# EAGLE design Qwiic RFID - IDXXLA-BottomJig (EAGLE 9.2.1)
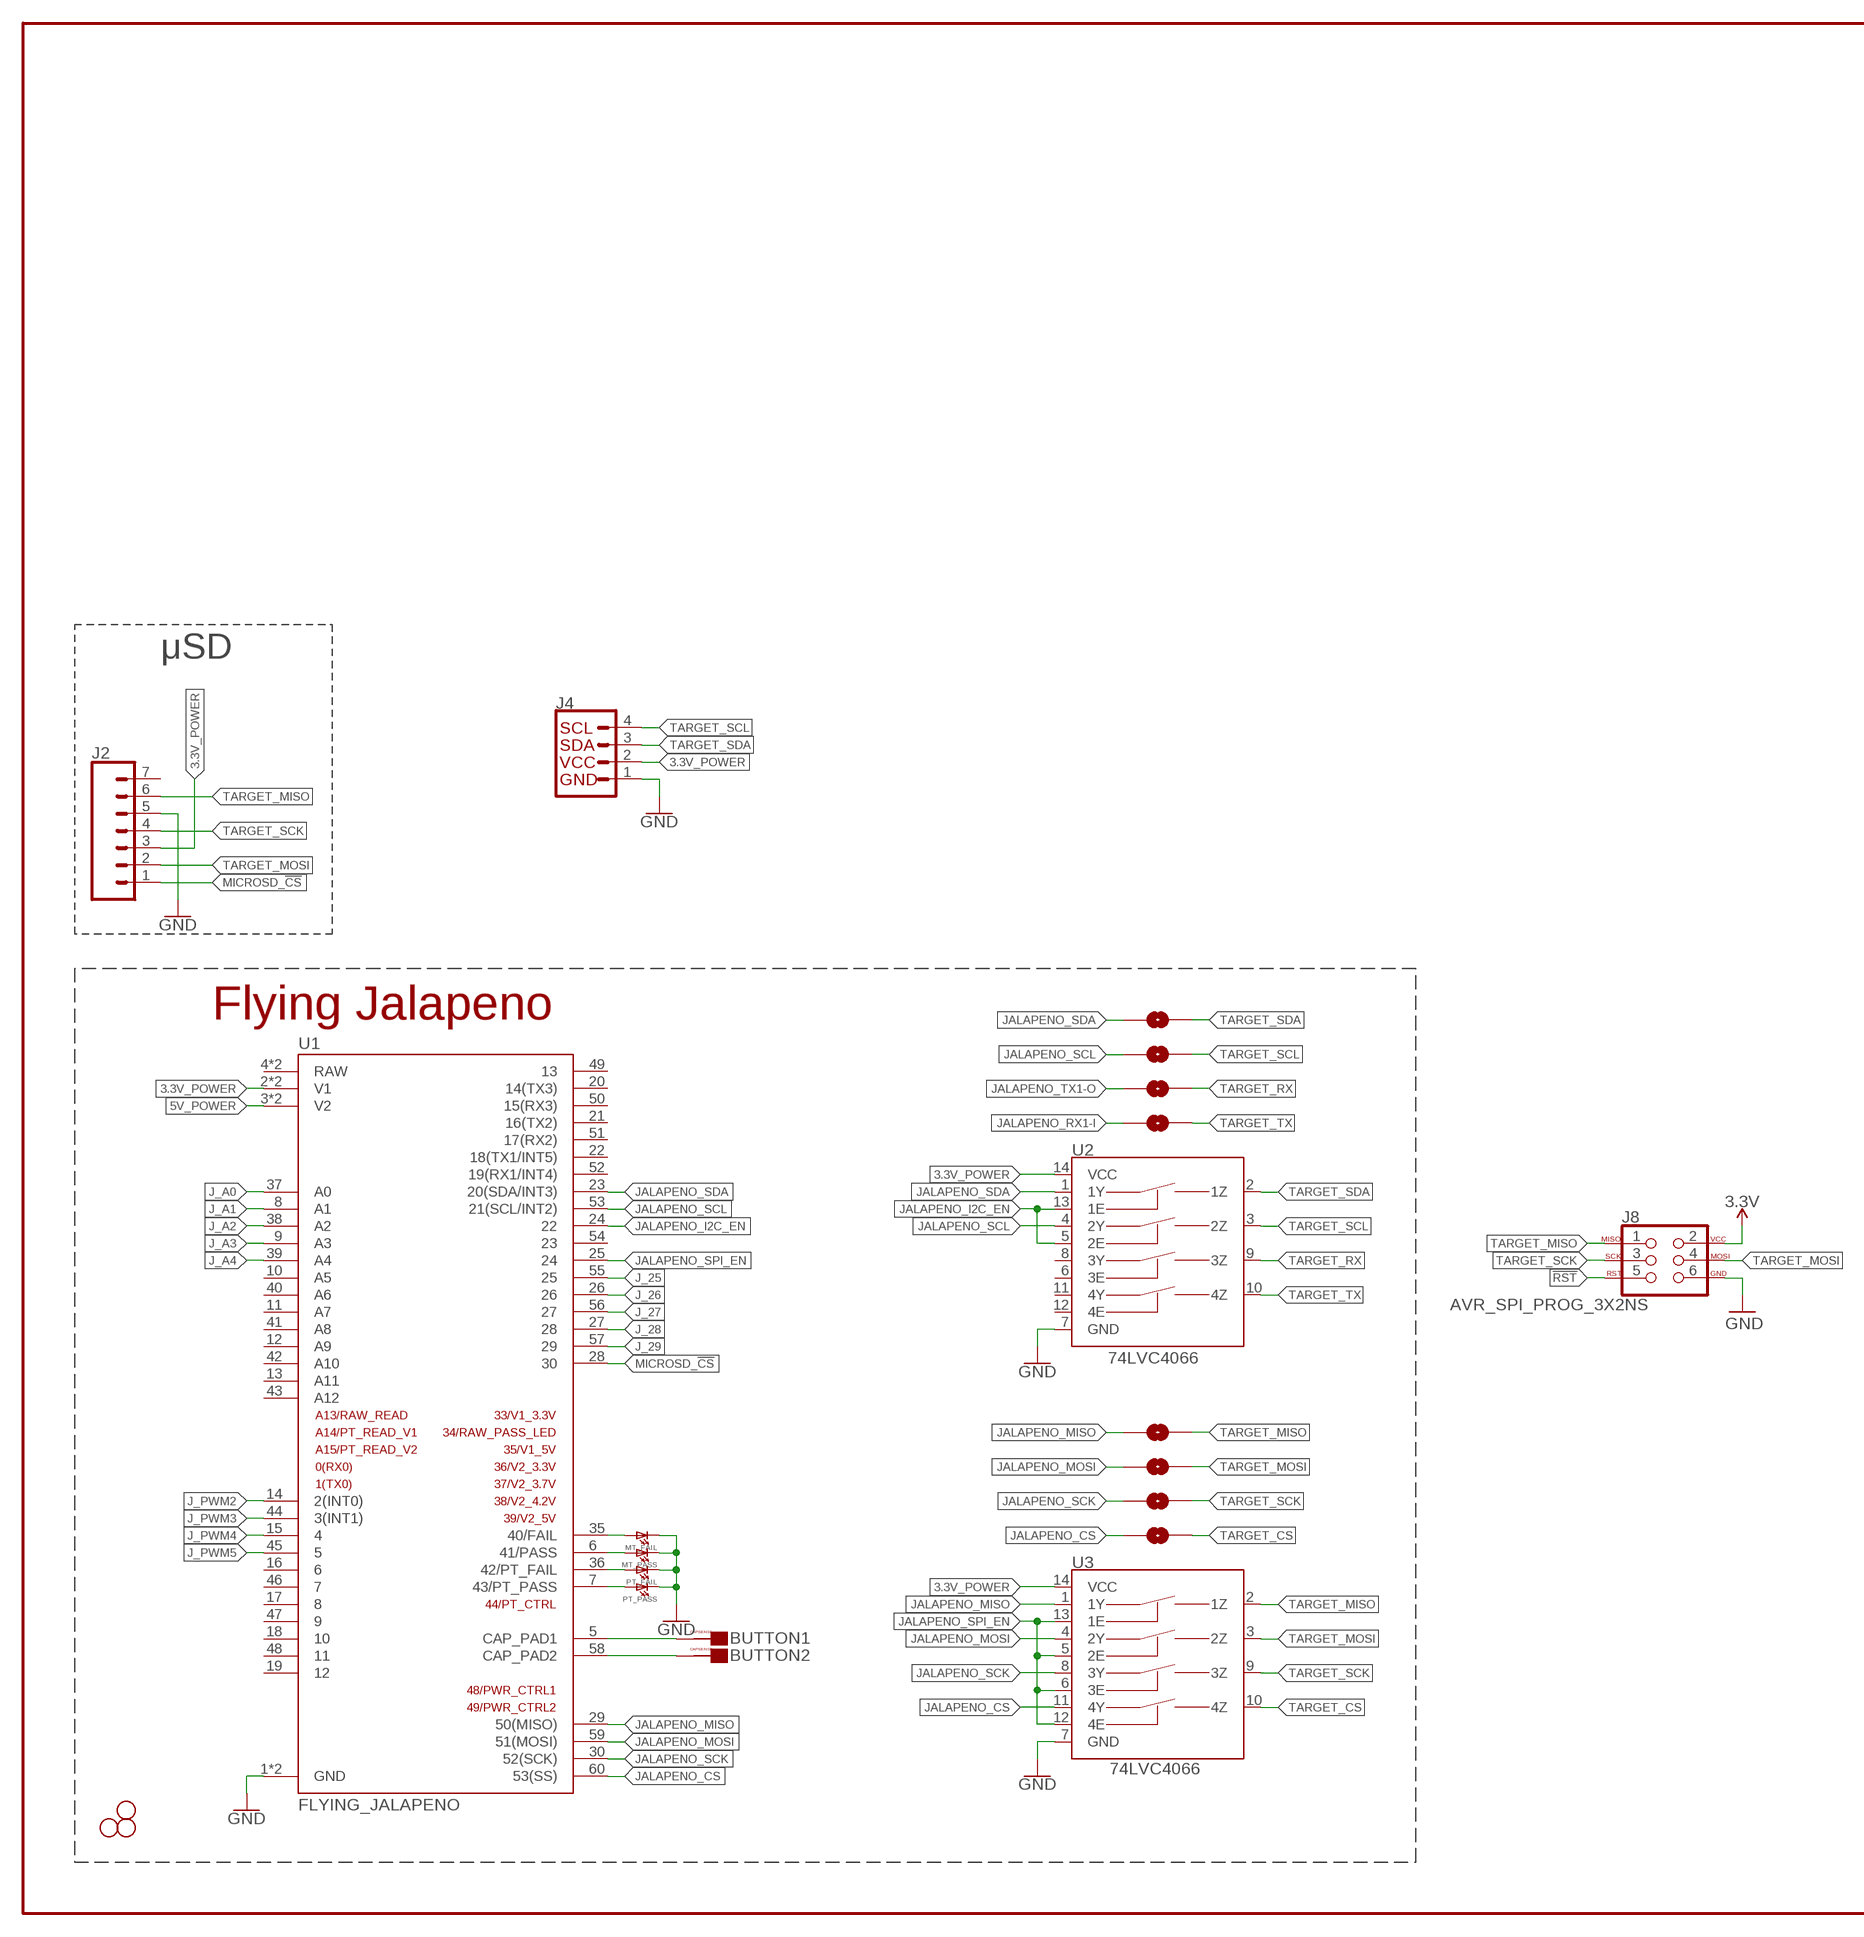
[diagram p0: schematic, sheet 1, part 1 of 2]
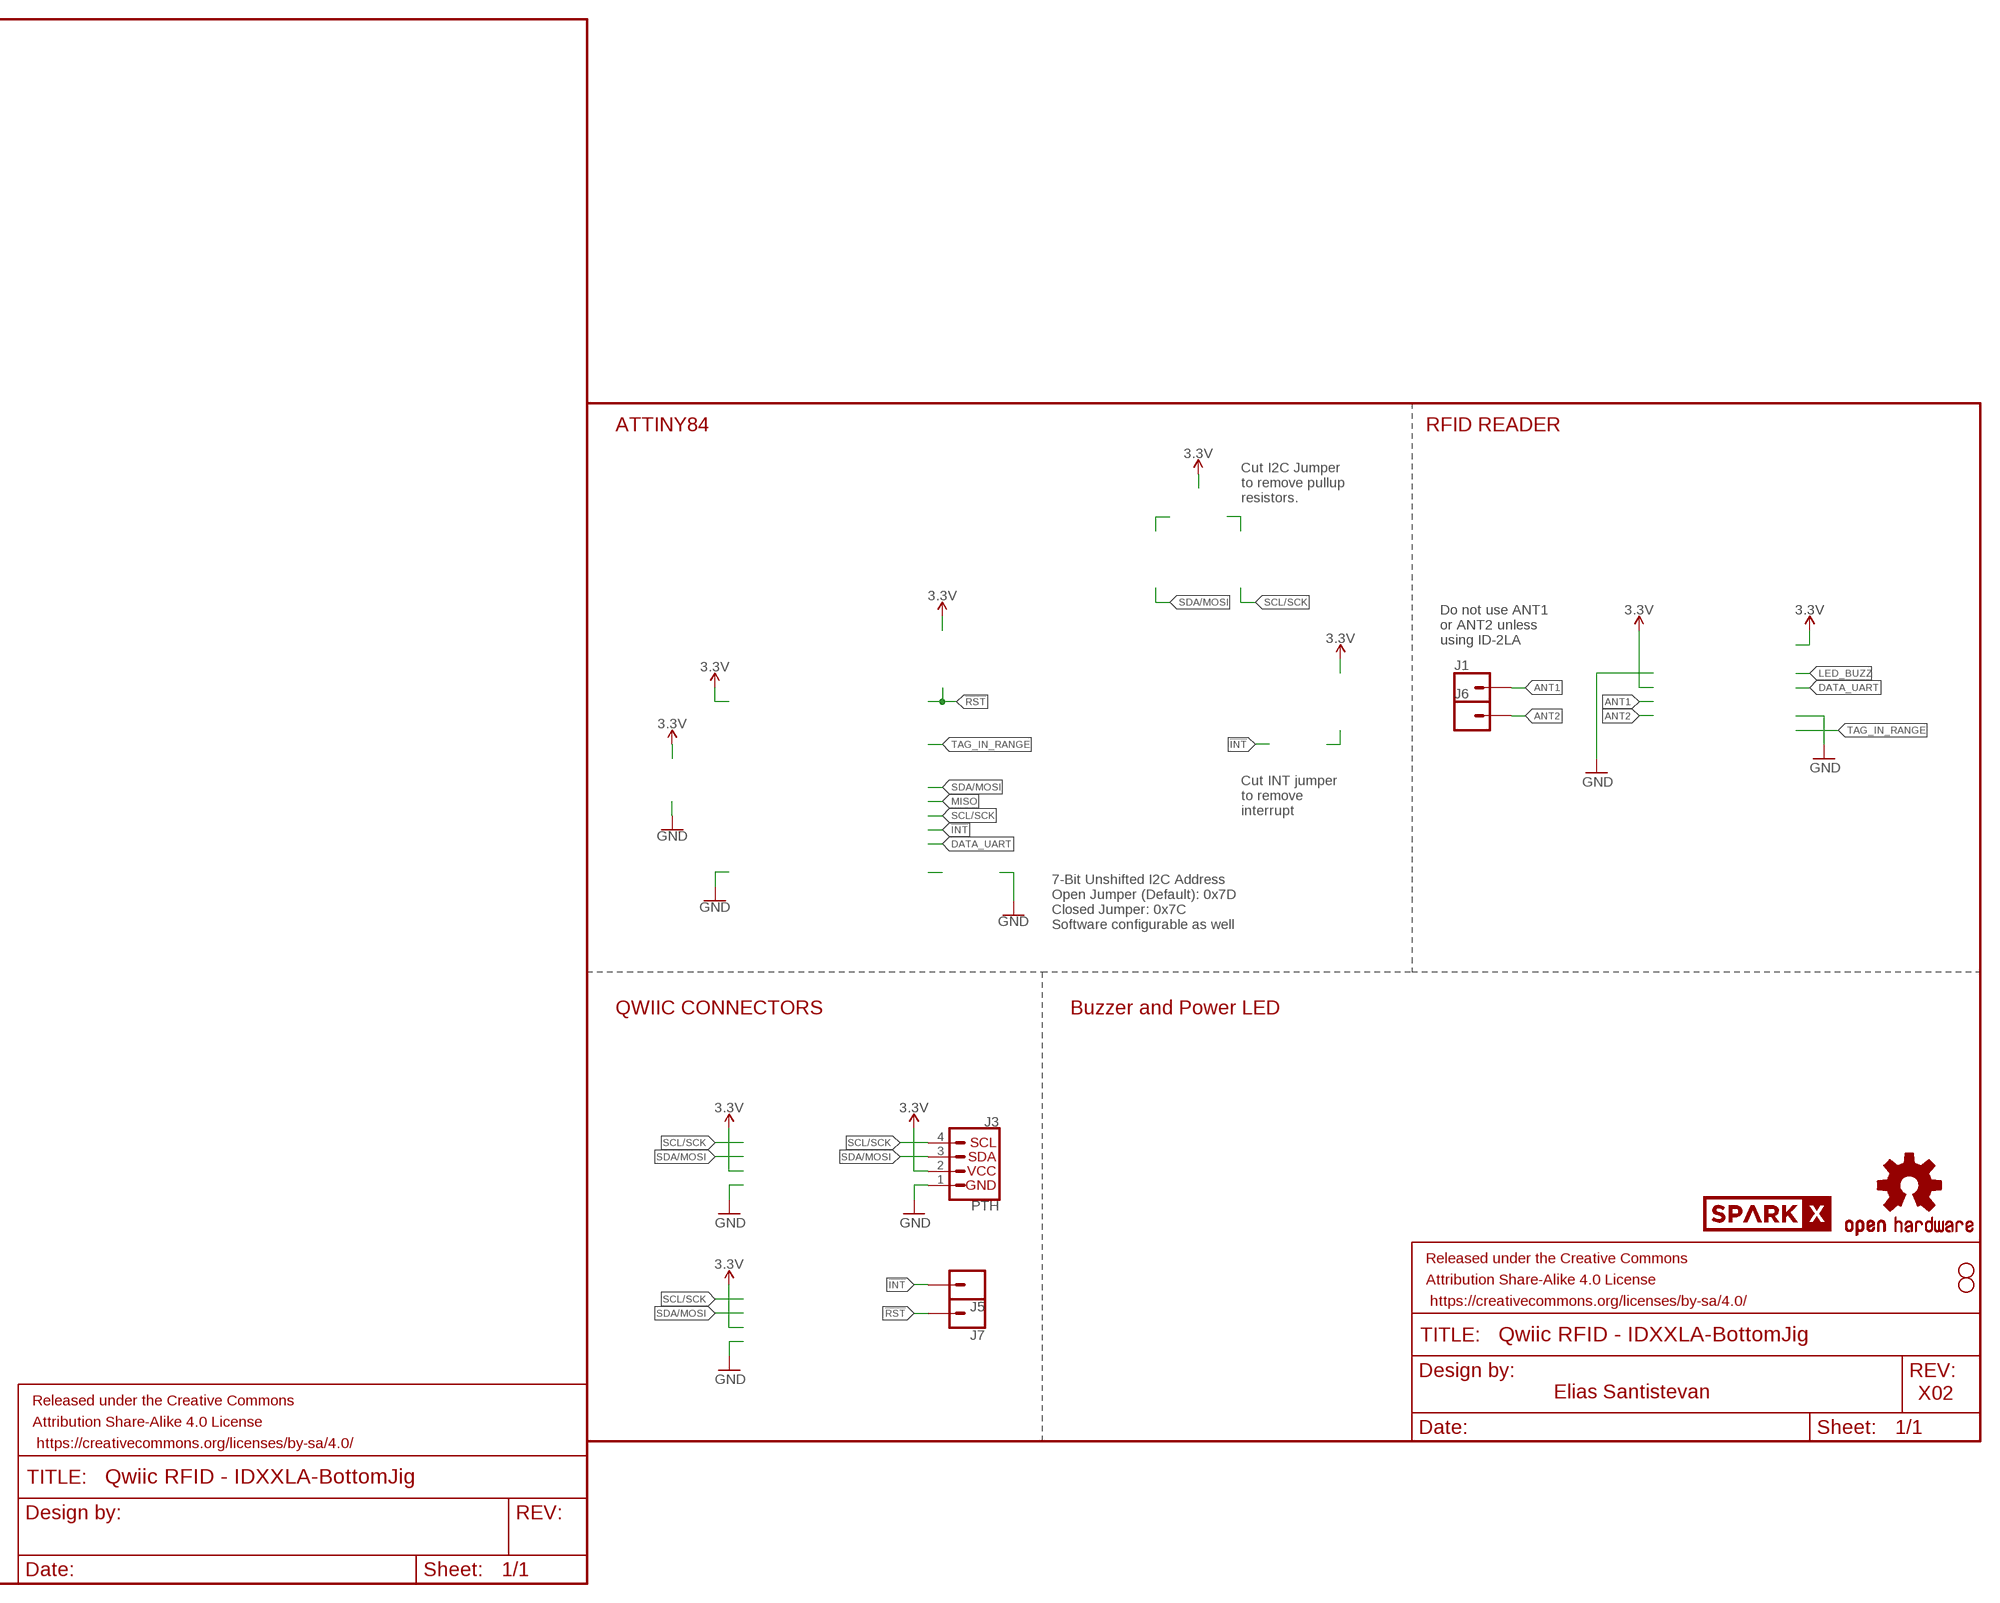
[diagram p1: schematic, sheet 1, part 2 of 2]

## Parts
BUTTON1  CAPSENSE_BUTTON_PAD_ONLY  [CAPSENSE_BUTTON_PADS_ONLY]
BUTTON2  CAPSENSE_BUTTON_PAD_ONLY  [CAPSENSE_BUTTON_PADS_ONLY]
FRAME1  FRAME-LETTER  [CREATIVE_COMMONS]
FRAME2  FRAME-LEDGER  [CREATIVE_COMMONS]
H1  STAND-OFF  [STAND-OFF]
H3  STAND-OFF  [STAND-OFF]
H4  STAND-OFF  [STAND-OFF]
J1  CONN_01PTH_NO_SILK_YES_STOP  [1X01_NO_SILK]
J2  CONN_07  [1X07]
J3  PTH  I2C_STANDARD_NO_SILK  [1X04_NO_SILK]
J4  QWIIC_CONNECTORJS-1MM  [1X04_1MM_RA]
J5  CONN_01PTH_NO_SILK_YES_STOP  [1X01_NO_SILK]
J6  CONN_01PTH_NO_SILK_YES_STOP  [1X01_NO_SILK]
J7  CONN_01PTH_NO_SILK_YES_STOP  [1X01_NO_SILK]
J8  AVR_SPI_PROG_3X2NS  [2X3-NS]
J_SCL  JUMPER-SMT_2_NO_NO-SILK  [SMT-JUMPER_2_NO_NO-SILK]
J_SCL1  JUMPER-SMT_2_NO_NO-SILK  [SMT-JUMPER_2_NO_NO-SILK]
J_SCL2  JUMPER-SMT_2_NO_NO-SILK  [SMT-JUMPER_2_NO_NO-SILK]
J_SCL3  JUMPER-SMT_2_NO_NO-SILK  [SMT-JUMPER_2_NO_NO-SILK]
J_SCL4  JUMPER-SMT_2_NO_NO-SILK  [SMT-JUMPER_2_NO_NO-SILK]
J_SCL5  JUMPER-SMT_2_NO_NO-SILK  [SMT-JUMPER_2_NO_NO-SILK]
J_SDA  JUMPER-SMT_2_NO_NO-SILK  [SMT-JUMPER_2_NO_NO-SILK]
J_SDA1  JUMPER-SMT_2_NO_NO-SILK  [SMT-JUMPER_2_NO_NO-SILK]
JP3  STAND-OFF  [STAND-OFF]
JP4  STAND-OFF  [STAND-OFF]
LOGO1  OSHW-LOGOMINI  [OSHW-LOGO-MINI]
MT_FAIL  LED1206  [LED-1206]
MT_PASS  LED1206  [LED-1206]
PT_FAIL  LED1206  [LED-1206]
PT_PASS  LED1206  [LED-1206]
U1  FLYING_JALAPENO  FLYING_JALAPENO_V3MALE  [FLYING_JALAPENO_V3_M]
U2  74LVC4066  74LVC4066_MUX_1:1_X4  [SO14]
U3  74LVC4066  74LVC4066_MUX_1:1_X4  [SO14]
U$4  SPARKX-LOGO3  [SPARKX-SMALL]

## Nets
3.3V: J3.2(VCC) J8.2
3.3V_POWER [VCC]: J2.3 J4.2 U1.2(V1) U1.32(V1) U2.14(VCC) U3.14(VCC)
5V_POWER [POWA]: U1.3(V2) U1.33(V2)
!INT: J5.1
!RST: J7.1 J8.5
ANT1: J1.1
ANT2: J6.1
BUTTON1 [CAPSENSE]: BUTTON1.CAPSENSE_PAD(CAPSENSE) U1.5(CAP_PAD1)
BUTTON2 [CAPSENSE]: BUTTON2.CAPSENSE_PAD(CAPSENSE) U1.58(CAP_PAD2)
GND: J2.5 J3.1(GND) J4.1 J8.6 MT_FAIL.C MT_PASS.C PT_FAIL.C PT_PASS.C U1.1(GND) U1.31(GND) U2.7(GND) U3.7(GND)
J_25: U1.55
J_26: U1.26
J_27: U1.56
J_28: U1.27
J_29: U1.57
J_A0: U1.37(A0)
J_A1: U1.8(A1)
J_A2: U1.38(A2)
J_A3: U1.9(A3)
J_A4: U1.39(A4)
J_PWM2: U1.14(2(INT0))
J_PWM3: U1.44(3(INT1))
J_PWM4: U1.15
J_PWM5: U1.45
JALAPENO_CS: J_SDA1.1 U1.60(53(SS)) U3.11(4Y)
JALAPENO_I2C_EN: U1.24 U2.5(2E) U2.13(1E)
JALAPENO_MISO: J_SCL5.1 U1.29(50(MISO)) U3.1(1Y)
JALAPENO_MOSI: J_SCL3.1 U1.59(51(MOSI)) U3.4(2Y)
JALAPENO_RX1-I: J_SDA.1
JALAPENO_SCK: J_SCL4.1 U1.30(52(SCK)) U3.8(3Y)
JALAPENO_SCL: J_SCL.1 U1.53(21(SCL/INT2)) U2.4(2Y)
JALAPENO_SDA: J_SCL2.1 U1.23(20(SDA/INT3)) U2.1(1Y)
JALAPENO_SPI_EN: U1.25 U3.5(2E) U3.6(3E) U3.12(4E) U3.13(1E)
JALAPENO_TX1-O: J_SCL1.1
MICROSD_!CS!: J2.1 U1.28
MT_FAIL: MT_FAIL.A U1.35(40/FAIL)
MT_PASS: MT_PASS.A U1.6(41/PASS)
PT_FAIL: PT_FAIL.A U1.36(42/PT_FAIL)
PT_PASS: PT_PASS.A U1.7(43/PT_PASS)
SCL/SCK: J3.4(SCL)
SDA/MOSI: J3.3(SDA)
TARGET_CS: J_SDA1.2 U3.10(4Z)
TARGET_MISO: J2.6 J8.1 J_SCL5.2 U3.2(1Z)
TARGET_MOSI: J2.2 J8.4 J_SCL3.2 U3.3(2Z)
TARGET_RX: J_SCL1.2 U2.9(3Z)
TARGET_SCK: J2.4 J8.3 J_SCL4.2 U3.9(3Z)
TARGET_SCL: J4.4 J_SCL.2 U2.3(2Z)
TARGET_SDA: J4.3 J_SCL2.2 U2.2(1Z)
TARGET_TX: J_SDA.2 U2.10(4Z)
Unconnected: J2.7 U1.4(RAW) U1.10(A5) U1.11(A7) U1.12(A9) U1.13(A11) U1.16 U1.17 U1.18 U1.19 U1.20(14(TX3)) U1.21(16(TX2)) U1.22(18(TX1/INT5)) U1.34(RAW) U1.40(A6) U1.41(A8) U1.42(A10) U1.43(A12) U1.46 U1.47 U1.48 U1.49 U1.50(15(RX3)) U1.51(17(RX2)) U1.52(19(RX1/INT4)) U1.54 U2.6(3E) U2.8(3Y) U2.11(4Y) U2.12(4E)

## Notes on the sheet
- ATTINY84 | RFID READER
- Cut I2C Jumper
  to remove pullup 
  resistors.
- μSD
- Do not use ANT1 
  or ANT2 unless 
  using ID-2LA
- Cut INT jumper
  to remove 
  interrupt
- Flying Jalapeno
- 7-Bit Unshifted I2C Address
  Open Jumper (Default): 0x7D
  Closed Jumper: 0x7C
  Software configurable as well
- QWIIC CONNECTORS | Buzzer and Power LED
- Elias Santistevan | X02

## Library data of the parts
BUTTON1 BUTTON2 = Testing:CAPSENSE_BUTTON_PAD_ONLY
FRAME1 = SparkFun-Aesthetics:FRAME-LETTER: Schematic Frame - Letter Standard 8.5x11 US Letter frame
FRAME2 = SparkFun-Aesthetics:FRAME-LEDGER: Schematic Frame - Ledger Standard 11x14 US Ledger frame
H1 H3 H4 = SparkFun-Hardware:STAND-OFF: Stand Off
J1 J5-J7 = SparkFun-Connectors:CONN_01: Single connection point. Often used as Generic Header-pin footprint for 0.1 inch spaced/style header connections On any of the 0.1 inch spaced packages, you can populate with these: Break Away Headers - Straight <https://www.sparkfun.com/products/116> (PRT-00116) Break Away Male Headers - Right Angle <https://www.sparkfun.com/products/553> (PRT-00553) Female Headers <https://www.sparkfun.com/products/115> (PRT-00115) Break Away Headers - Machine Pin <https://www.sparkfun.com/products/117> (PRT-00117) Break Away Female Headers - Swiss Machine Pin <https://www.sparkfun.com/products/743> (PRT-00743) This device is also useful as a general connection point to wire up your design to another part of your project. Our various solder wires solder well into these plated through hole pads. Hook-Up Wire - Assortment (Stranded, 22 AWG) <https://www.sparkfun.com/products/11375> (PRT-11375) Hook-Up Wire - Assortment (Solid Core, 22 AWG) <https://www.sparkfun.com/products/11367> (PRT-11367) View the entire wire category on our website here <https://www.sparkfun.com/categories/141> Special notes: SMTSO-256-ET is a "flush mount" nut for a 4-40 screw. We mostly use this on specialty testbeds; it is a nice way to connect hardware to your PCB at an adjustable hieght. Also note, the SNAP packages are for using a snappable style connector. We sell a baggie of snaps and they are also used on two LilyPad designs: Snap Assortment - 30 pack (male and female) <https://www.sparkfun.com/products/11347> (DEV-11347) LilyPad Arduino SimpleSnap <https://www.sparkfun.com/products/10941> (DEV-10941) LilyPad SimpleSnap Protoboard <https://www.sparkfun.com/products/10940> (DEV-10940)
J2 = SparkFun-Connectors:CONN_07: Multi connection point. Often used as Generic Header-pin footprint for 0.1 inch spaced/style header connections On any of the 0.1 inch spaced packages, you can populate with these: Break Away Headers - Straight <https://www.sparkfun.com/products/116> (PRT-00116) Break Away Male Headers - Right Angle <https://www.sparkfun.com/products/553> (PRT-00553) Female Headers <https://www.sparkfun.com/products/115> (PRT-00115) Break Away Headers - Machine Pin <https://www.sparkfun.com/products/117> (PRT-00117) Break Away Female Headers - Swiss Machine Pin <https://www.sparkfun.com/products/743> (PRT-00743) For SCREWTERMINALS and SPRING TERMINALS visit here: Screw Terimnals on SparkFun.com <https://www.sparkfun.com/search/results?term=Screw+Terminals> (5mm/3.5mm/2.54mm spacing) This device is also useful as a general connection point to wire up your design to another part of your project. Our various solder wires solder well into these plated through hole pads. Hook-Up Wire - Assortment (Stranded, 22 AWG) <https://www.sparkfun.com/products/11375> (PRT-11375) Hook-Up Wire - Assortment (Solid Core, 22 AWG) <https://www.sparkfun.com/products/11367> (PRT-11367) View the entire wire category on our website here <https://www.sparkfun.com/categories/141> Special notes: Molex polarized connector foot print use with SKU : PRT-08231 with associated crimp pins and housings. 1MM SMD Version SKU: PRT-10208 NOTES ON THE VARIANTS LOCK and LOCK_LONGPADS... This footprint was designed to help hold the alignment of a through-hole component (i.e. 6-pin header) while soldering it into place. You may notice that each hole has been shifted either up or down by 0.005 of an inch from it's more standard position (which is a perfectly straight line). This slight alteration caused the pins (the squares in the middle) to touch the edges of the holes. Because they are alternating, it causes a "brace" to hold the component in place. 0.005 has proven to be the perfect amount of "off-center" position when using our standard breakaway headers. Although looks a little odd when you look at the bare footprint, once you have a header in there, the alteration is very hard to notice. Also,if you push a header all the way into place, it is covered up entirely on the bottom side.
J3 = SparkX:I2C_STANDARD: SparkFun I2C Standard Pinout Header SparkFun has standardized on a pinout for all I2C based sensor breakouts. This pinout allows I2C boards to be plugged directly into the headers on Arduino Uno compatible boards, and to be daisy chained easily. Example SparkFun Products: SparkFun Atmospheric Sensor Breakout - BME280 <https://www.sparkfun.com/products/13676> SparkFun Altitude/Pressure Sensor Breakout - MPL3115A2 <https://www.sparkfun.com/products/11084> SparkFun TOF Range Finder Sensor - VL6180 <https://www.sparkfun.com/products/12785>
J4 = SparkFun-Connectors:QWIIC_CONNECTOR: SparkFun I2C Standard Qwiic Connector An SMD 1mm pitch JST connector makes it easy and quick (get it? Qwiic?) to connect I2C devices to each other. The Qwiic system <http://www.sparkfun.com/qwiic> enables fast and solderless connection between popular platforms and various sensors and actuators. We carry 200mm <https://www.sparkfun.com/products/14204>, 100mm <https://www.sparkfun.com/products/14205>, 50mm <https://www.sparkfun.com/products/14206>, and breadboard friendly <https://www.sparkfun.com/products/14207> Qwiic cables. We also offer 10 pcs strips <https://www.sparkfun.com/products/14323> the SMD connectors.; PROD_ID: CONN-13694
J8 = SparkFun-Connectors:AVR_SPI_PROG_3X2: AVR ISP 6 Pin This is the reduced ISP connector for AVR programming. Common on Arduino. This footprint will take up less PCB space and can be used with a 10-pin to 6-pin adapter such as SKU: BOB-08508 **Special note about "TEST_POINT" package. The stop mask is on the top side, so if you want your programming test points to be on the bottom of your board, make sure to place this package on the bottom side of the board. This also ensure that the orientation to program from the bottom side will be correct. SparkFun Products: SparkFun ISP Pogo Adapter <https://www.sparkfun.com/products/11591> - NS Tiny AVR Programmer <https://www.sparkfun.com/products/11801> -PTH
J_SCL J_SCL1-J_SCL5 J_SDA J_SDA1 = SparkFun-Jumpers:JUMPER-SMT_2_NO: Normally open jumper This jumper has two pads in close proximity to each other. Apply solder to close the connection. Round pads are easier to solder for beginners, but are a lot larger. SparkFun Product that uses the round pads: SparkFun EL Sequencer <https://www.sparkfun.com/products/12781>
JP3 JP4 = SparkFun:STAND-OFF: Stand Off
LOGO1 = SparkFun-Aesthetics:OSHW-LOGO: Open-Source Hardware (OSHW) Logo This logo indicates the piece of hardware it is found on incorporates a OSHW license and/or adheres to the definition of open source hardware found here: http://freedomdefined.org/OSHW
MT_FAIL MT_PASS PT_FAIL PT_PASS = Testing:LED: LEDs Standard schematic elements and footprints for 5mm, 3mm, 1206, and 0603 sized LEDs. 5mm - Spark Fun Electronics SKU : COM-00529 (and others)
U1 = Testing:FLYING_JALAPENO_V3
U2 U3 = Testing:74LVC4066_MUX_1:1_X4
U$4 = SparkX:SPARKX-LOGO

## Net classes
1 VCC: width 0.381 mm
2 POWA: width 0.61 mm
3 CAPSENSE: width 0.508 mm

## Board
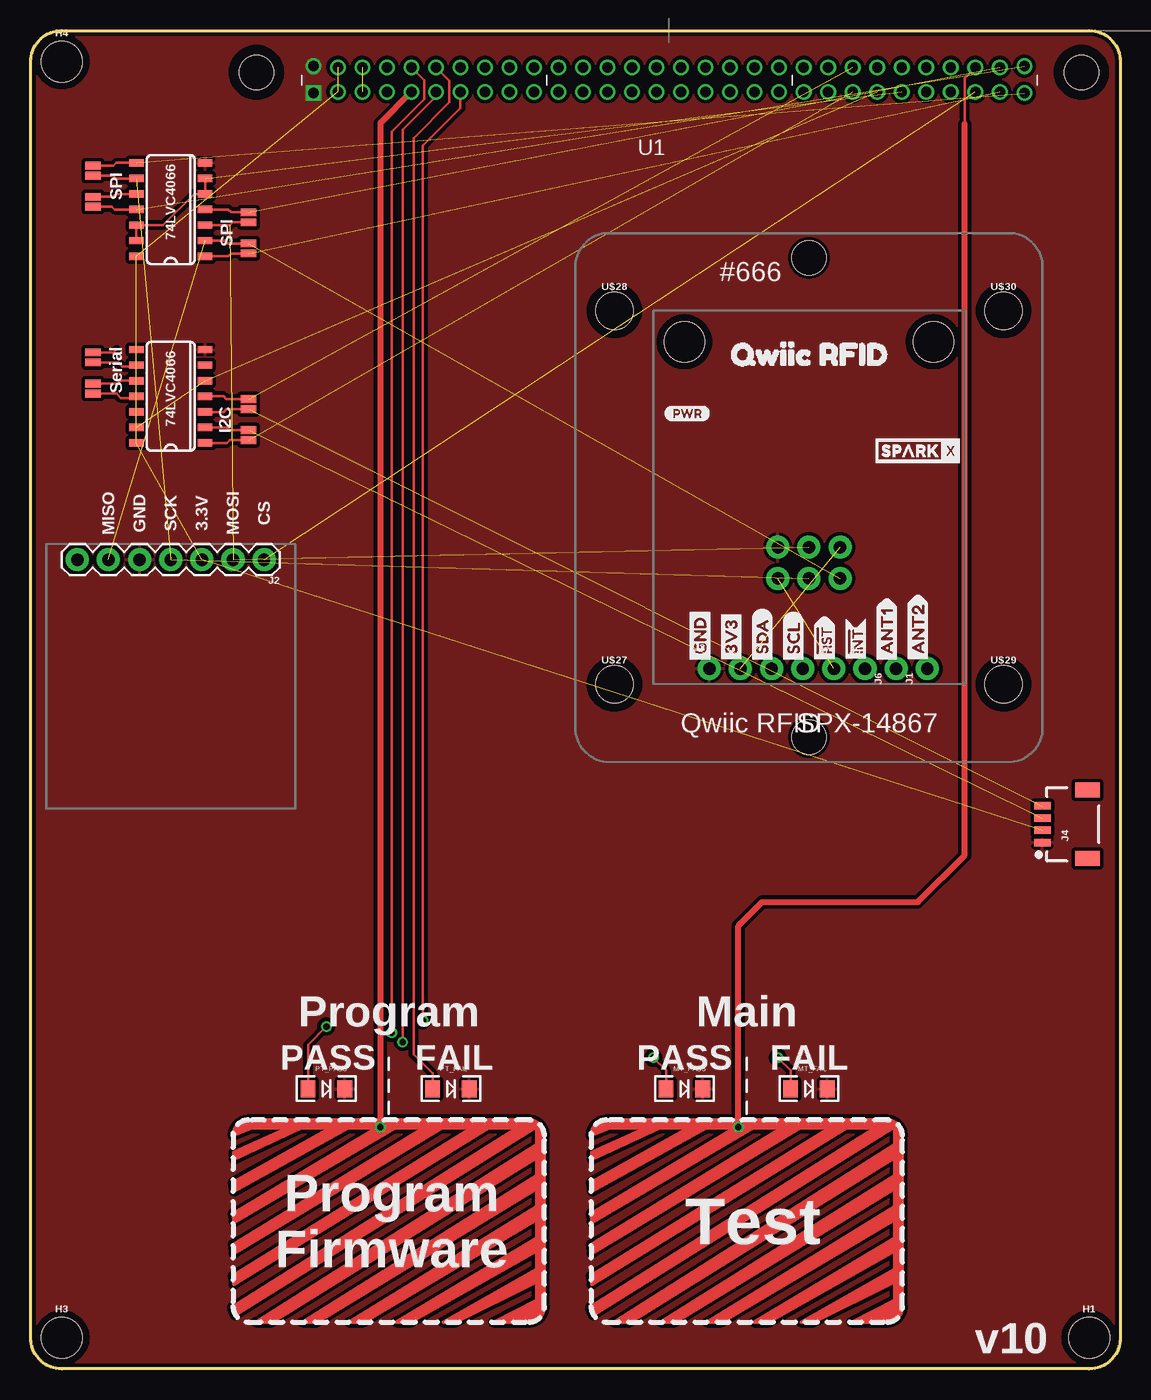
[diagram p2: board, top side]
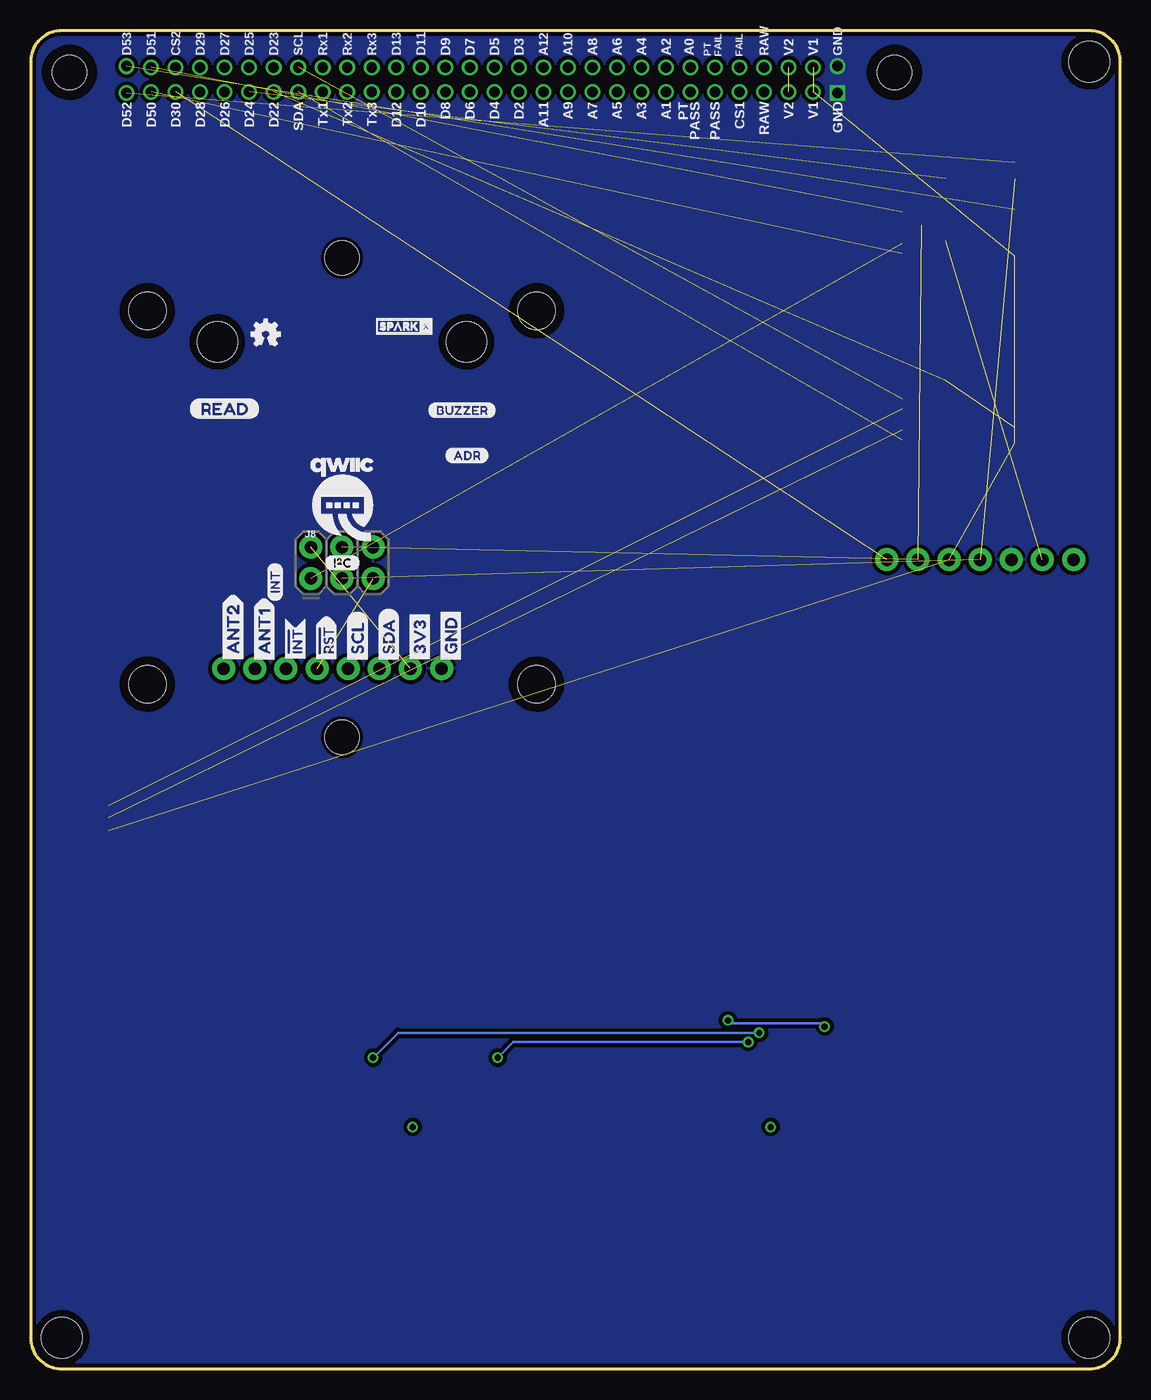
[diagram p3: board, bottom side, seen from below]

Size 88.9 x 109.22 mm. Coordinates in mm from the lower left corner, seen from the top.
Outline: 2.54,109.22 86.36,109.22 arc-90 88.9,106.68 88.9,2.54 arc-90 86.36,0 2.54,0 arc-90 0,2.54 0,106.68 arc-90 2.54,109.22
Copper layers (1*16): Top 0.035mm / dielectric 1.5mm / Bottom 0.035mm
Design rules "SparkFun-2-layer-TIGHT": minimum track width 7mil, minimum drill 15mil, track to track 7mil, track to pad 7mil, pad to pad 7mil, via to via 7mil, smd to smd 7mil, copper to edge 7mil, drill to drill 7mil, minimum pad ring 7mil, minimum via ring 7mil, stop-mask expansion 4mil, vias tented up to drill 25mil, thermal gap 10mil

### Footprints (pad centres in the part's own frame; a part is rotated, then mirrored left to right if it is on the bottom)
CAPSENSE_BUTTON_PADS_ONLY = drill 0.508: CAPSENSE_PAD -0.686,7.036
STAND-OFF = hole 3.302: 0,0
1X01_NO_SILK = drill 1.016 pad 1.88: 1 0,0
1X07 = drill 1.016 pad 1.88: 1 0,0; 2 2.54,0; 3 5.08,0; 4 7.62,0; 5 10.16,0; 6 12.7,0; 7 15.24,0
1X04_NO_SILK = drill 1.016 pad 1.88: 1 0,0; 2 2.54,0; 3 5.08,0; 4 7.62,0
1X04_1MM_RA = smd 0.6 x 1.35: 1 -1.5,0; 2 -0.5,0; 3 0.5,0; 4 1.5,0 | smd 1.2 x 2: NC1 2.8,-3.675; NC2 -2.8,-3.675
2X3-NS = drill 1.016 pad 1.88: 1 -2.54,-1.27; 2 -2.54,1.27; 3 0,-1.27; 4 0,1.27; 5 2.54,-1.27; 6 2.54,1.27
SMT-JUMPER_2_NO_NO-SILK = smd 0.635 x 1.27: 1 -0.406,0; 2 0.406,0
LED-1206 = smd 1.2 x 1.4: A -1.5,0; C 1.5,0
FLYING_JALAPENO_V3_M = drill 0.85 square: 1 -29,-5.1 | drill 0.85: 2 -27,-5; 3 -25,-5; 4 -23,-5; 5 -21,-5; 6 -19,-5; 7 -17,-5; 8 -15,-5; 9 -13,-5; 10 -11,-5; 11 -9,-5; 12 -7,-5; 13 -5,-5; 14 -3,-5; 15 -1,-5; 16 1,-5; 17 3,-5; 18 5,-5; 19 7,-5; 20 9,-5; 21 11,-5; 22 13,-5; 23 15,-5; 24 17,-5; 25 19,-5; 26 21,-5; 27 23,-5; 28 25,-5; 29 27,-5; 30 29,-5.1; 31 -29,-2.9; 32 -27,-3; 33 -25,-3; 34 -23,-3; 35 -21,-3; 36 -19,-3; 37 -17,-3; 38 -15,-3; 39 -13,-3; 40 -11,-3; 41 -9,-3; 42 -7,-3; 43 -5,-3; 44 -3,-3; 45 -1,-3; 46 1,-3; 47 3,-3; 48 5,-3; 49 7,-3; 50 9,-3; 51 11,-3; 52 13,-3; 53 15,-3; 54 17,-3; 55 19,-3; 56 21,-3; 57 23,-3; 58 25,-3; 59 27,-3; 60 29,-2.9 | hole 2.794: 33.655,-3.404; -33.655,-3.404
SO14 = smd 0.6 x 1.2: 1 -3.175,-2.8; 2 -1.905,-2.8; 3 -0.635,-2.8; 4 0.635,-2.8; 5 1.905,-2.8; 6 3.175,-2.8; 7 4.445,-2.8; 8 4.445,2.8; 9 3.175,2.8; 10 1.905,2.8; 11 0.635,2.8; 12 -0.635,2.8; 13 -1.905,2.8; 14 -3.175,2.8
STAND-OFF-TIGHT = hole 3.048: 0,0
NUBBIN_LOCKER = hole 2.794: 0,0

### Placement (x,y rotation side)
BUTTON1  29.21,12.7 0 top
BUTTON2  58.42,12.7 0 top
FRAME1  -8.89,-10.16 0 top  (outside the outline)
FRAME2  -8.89,-19.05 0 top  (outside the outline)
H1  86.36,2.54 0 top
H3  2.54,2.54 0 top
H4  2.54,106.68 0 top
J1  73.15,57.15 90 top
J2  19.05,66.04 180 top
J3  55.37,57.15 0 top
J4  82.55,44.45 90 top
J5  68.07,57.15 0 top
J6  70.61,57.15 90 top
J7  65.53,57.15 0 top
J8  63.5,65.79 0 bottom
J_SCL  17.78,78.74 270 top
J_SCL1  5.08,82.55 270 top
J_SCL2  17.78,76.2 90 top
J_SCL3  17.78,93.98 270 top
J_SCL4  5.08,97.79 270 top
J_SCL5  17.78,91.44 90 top
J_SDA  5.08,80.01 90 top
J_SDA1  5.08,95.25 90 top
JP3  53.34,83.82 0 top
JP4  73.66,83.82 0 top
LOGO1  69.72,84.45 0 bottom
MT_FAIL  63.5,22.86 0 top
MT_PASS  53.34,22.86 0 top
PT_FAIL  34.29,22.86 0 top
PT_PASS  24.13,22.86 0 top
U1  52.07,109.22 0 top
U2  11.43,78.74 90 top
U3  11.43,93.98 90 top
U$1  [SPARKX-TINY]  58.42,85.09 0 bottom
U$2  [I_SUPER2_C-()-03]  64.9,65.79 0 bottom
U$3  [ANT20]  72.39,57.4 90 bottom
U$4  72.39,74.93 0 top
U$5  [RST#-[>]  64.77,57.28 90 top
U$6  [SDA-[)]  59.69,57.4 90 top
U$7  [SCL-[)]  62.23,57.4 90 top
U$8  [QWIIC-LOGO-MEDIUM]  63.5,70.99 0 bottom
U$9  [GND-04]  54.61,57.4 90 top
U$10  [3V3-04]  57.15,57.4 90 top
U$11  [INT#-[<]  67.31,57.28 90 top
U$12  [ADR0]  55.12,74.55 0 bottom
U$13  [INT0]  68.96,62.61 90 bottom
U$14  [PWR-()-03]  51.69,77.98 0 top
U$15  [BUZZER0]  56.52,78.23 0 bottom
U$16  [ANT10]  69.85,57.4 90 top
U$17  [ANT20]  72.39,57.4 90 top
U$18  [READ0]  75.95,78.36 0 bottom
U$19  [QWIIC_RFID0]  55.5,82.8 0 top
U$20  [ANT10]  69.85,57.4 90 bottom
U$21  [INT#-[<]  67.31,57.28 90 bottom
U$22  [SCL-[)]  62.23,57.4 90 bottom
U$23  [SDA-[)]  59.69,57.4 90 bottom
U$24  [3V3-04]  57.15,57.4 90 bottom
U$25  [GND-04]  54.61,57.4 90 bottom
U$26  [RST#-[>]  64.77,57.28 90 bottom
U$27  [STAND-OFF-TIGHT]  47.62,55.88 0 top
U$28  [STAND-OFF-TIGHT]  47.62,86.36 0 top
U$29  [STAND-OFF-TIGHT]  79.38,55.88 0 top
U$30  [STAND-OFF-TIGHT]  79.38,86.36 0 top
U$31  [NUBBIN_LOCKER]  63.5,51.56 0 top
U$32  [NUBBIN_LOCKER]  63.5,90.68 0 top

### Tracks (layer width: path | path; a pad name or v marks a point on that pad's centre or on a via)
3.3V  (1 unrouted)
3.3V_POWER  (5 unrouted)
5V_POWER  (1 unrouted)
!RST  (1 unrouted)
BUTTON1
  Top 0.508: U1.5 28.52,101.67 BUTTON1.CAPSENSE_PAD
BUTTON2
  Top 0.203: 76.2,101.6 76.2,105.35 U1.58
  Top 0.508: BUTTON2.CAPSENSE_PAD 57.73,36.14 59.69,38.1 72.39,38.1 76.2,41.91 76.2,101.6
GND
  pour Top (isolate 0.305): 0,109.22 88.9,109.22 88.9,0 0,0
  pour Bottom (isolate 0.305): 0,109.22 88.9,109.22 88.9,0 0,0
JALAPENO_CS  (1 unrouted)
  Top 0.203: J_SDA1.1 6.63,94.84 6.86,94.61 U3.11
JALAPENO_I2C_EN  (2 unrouted)
JALAPENO_MISO  (1 unrouted)
  Top 0.203: J_SCL5.1 16.36,91.03 16.13,90.81 U3.1
JALAPENO_MOSI  (1 unrouted)
  Top 0.203: J_SCL3.1 16.36,94.39 16.13,94.61 U3.4
JALAPENO_RX1-I
  Top 0.203: J_SDA.1 7.01,79.6 7.37,79.25 8.5,79.25
JALAPENO_SCK  (1 unrouted)
  Top 0.203: J_SCL4.1 6.76,98.2 6.99,98.42 U3.8
JALAPENO_SCL  (1 unrouted)
  Top 0.203: J_SCL.1 15.98,79.15 15.75,79.38 U2.4
JALAPENO_SDA  (1 unrouted)
  Top 0.203: U2.1 16,75.56 16.23,75.79 J_SCL2.1
JALAPENO_SPI_EN  (1 unrouted)
  Top 0.203: U3.6 U3.5 13.34,95.89 10.79,93.34 U3.12 U3.13
JALAPENO_TX1-O
  Top 0.203: J_SCL1.1 6.76,82.96 6.99,83.19
MICROSD_!CS!  (1 unrouted)
MT_FAIL  (via drill 0.51)
  Top 0.203: MT_FAIL.A 62,24.36 v60.96,25.4 | v29.46,27.43 29.46,100.97 32.13,103.63 32.13,105.16 U1.35
  Bottom 0.203: v60.96,25.4 58.93,27.43 v29.46,27.43
MT_PASS  (via drill 0.51)
  Top 0.203: MT_PASS.A 51.84,24.36 v50.8,25.4 | v30.35,26.67 30.35,101.12 33.07,103.84 U1.6
  Bottom 0.203: v50.8,25.4 49.53,26.67 v30.35,26.67
PT_FAIL
  Top 0.203: 33.02,23.09 PT_FAIL.A 32.79,24.11 31.24,25.65 31.24,100.46 34.16,103.38 34.16,105.13 U1.36
PT_PASS  (via drill 0.51)
  Top 0.203: PT_PASS.A 22.63,26.44 v24.13,27.94 | U1.7 35.07,102.89 32,99.82 v32,28.45
  Bottom 0.203: v24.13,27.94 24.38,28.19 31.75,28.19 v32,28.45
TARGET_CS
  Top 0.203: J_SDA1.2 6.76,95.66 6.99,95.89 U3.10
TARGET_MISO  (2 unrouted)
  Top 0.203: J_SCL5.2 16.1,91.85 15.88,92.08 U3.2
TARGET_MOSI  (2 unrouted)
  Top 0.203: J_SCL3.2 16.48,93.57 16.26,93.34 U3.3
TARGET_RX
  Top 0.203: J_SCL1.2 7.14,82.14 7.49,81.79 8.5,81.79 U2.9
TARGET_SCK  (2 unrouted)
  Top 0.203: J_SCL4.2 6.76,97.38 6.99,97.16 U3.9
TARGET_SCL  (1 unrouted)
  Top 0.203: J_SCL.2 15.98,78.33 15.75,78.11 U2.3
TARGET_SDA  (1 unrouted)
  Top 0.203: J_SCL2.2 16.23,76.61 16,76.83 U2.2
TARGET_TX
  Top 0.203: U2.10 7.37,80.64 7.11,80.39 7.09,80.42 J_SDA.2

### Text on the board
tPlace: SPI | SPI | #666 | Serial | I2C | MISO | GND | SCK | 3.3V | MOSI | CS | Qwiic RFID | SPX-14867 | Program | Main | PASS | FAIL | PASS | FAIL | Program / Firmware | Test | v10
Measures: Units in Inches
tDocu: Elias Santistevan